# Altium project 飞镖测速模块.PrjPcb
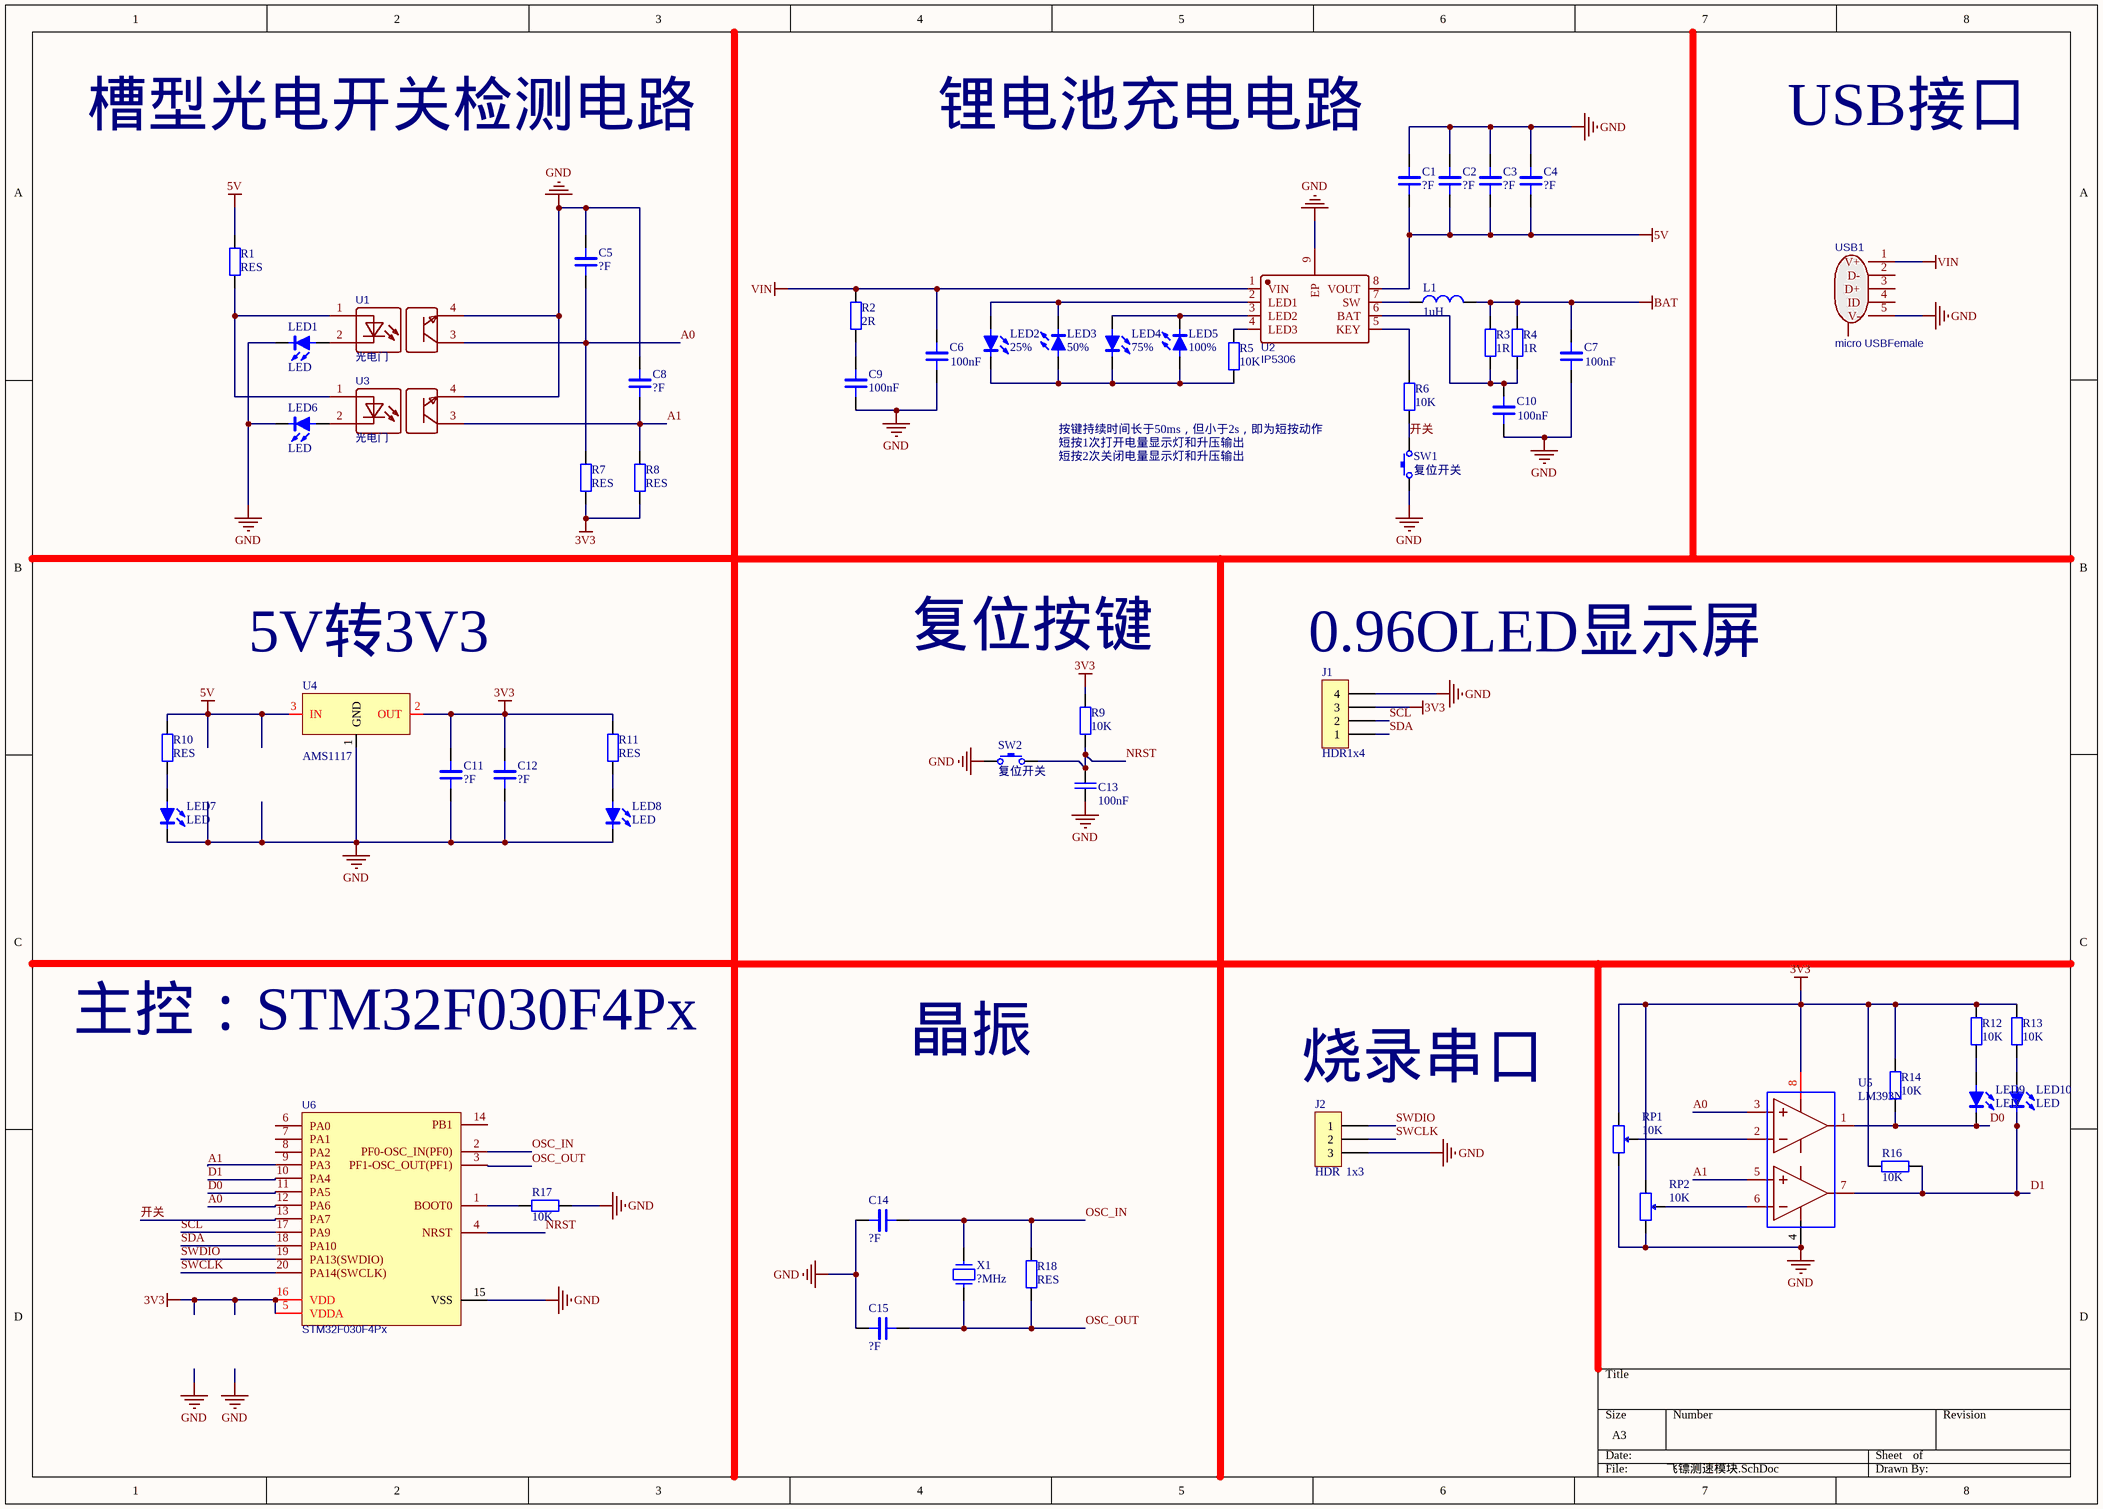
[diagram p0: 飞镖测速模块.SchDoc]
1 sheet, 57 parts. Net scope: global (net labels, ports and power ports of the same name join across sheets).
Board file: 飞镖测速模块.PcbDoc

## Sheet 飞镖测速模块.SchDoc
size A3; SheetNumber: 1; SheetTotal: 1

### Parts
C1  ?F  [1206_C]
C2  ?F  [1206_C]
C3  ?F  [1206_C]
C4  ?F  [1206_C]
C5  ?F  [0603_C]
C6  100nF  [0603_C]
C7  100nF  [0603_C]
C8  ?F  [0603_C]
C9  100nF  [0603_C]
C10  100nF  [0603_C]
C11  ?F  [1206_C]
C12  ?F  [1206_C]
C13  100nF  [0603_C]
C14  ?F  [0603_C]
C15  ?F  [0603_C]
J1  HDR1x4  [排针排母 4P 2.54mm]
J2  HDR  1x3  [排针排母 3P 2.54mm]
L1  1uH  [SMD_4*4*3MM]
LED1  LED  [LED_0603]
LED2  25%  [LED_0603]
LED3  50%  [LED_0603]
LED4  75%  [LED_0603]
LED5  100%  [LED_0603]
LED6  LED  [LED_0603]
LED7  LED  [LED_0603]
LED8  LED  [LED_0603]
LED9  LED  [LED_0603]
LED10  LED  [LED_0603]
R1  RES  [0603_R]
R2  2R  [0603_R]
R3  1R  [0603_R]
R4  1R  [0603_R]
R5  10K  [0603_R]
R6  10K  [0603_R]
R7  RES  [0603_R]
R8  RES  [0603_R]
R9  10K  [0603_R]
R10  RES  [0603_R]
R11  RES  [0603_R]
R12  10K  [0603_R]
R13  10K  [0603_R]
R14  10K  [0603_R]
R16  10K  [0603_R]
R17  10K  [0603_R]
R18  RES  [0603_R]
RP1  10K  [RM065]
RP2  10K  [RM065]
SW1  复位开关  [SW-按键]
SW2  复位开关  [SW-按键]
U1  光电门  [ZGY1150(ITR)]
U2  IP5306  [SOP8-EP]
U3  光电门  [ZGY1150(ITR)]
U4  AMS1117  [SOT-223]
U5  LM393N  [SOP8]
U6  STM32F030F4Px  [TSSOP-20]
USB1  micro USBFemale  [MICRO-USB-SMD_5P-P0.65-H-F_C10418]
X1  ?MHz  [XTAL 直插]

### Nets
3V3: C11.2 C12.2 J1.3 R7.2 R8.2 R9.2 R11.2 R12.1 R13.1 R14.2 R16.1 RP1.1 RP2.1 U4.2(OUT) U5.8(V+) U6.5(VDDA) U6.16(VDD)
5V: C1.1 C2.1 C3.1 C4.1 R1.1 R10.2 U2.8(VOUT) U4.3(IN)
BAT: C7.2 L1.2 R3.2 R4.2
GND: C1.2 C2.2 C3.2 C4.2 C5.2 C6.1 C7.1 C8.2 C9.1 C10.1 C11.1 C12.1 C13.2 C14.2 C15.2 J1.4 J2.3 LED1.2(C) LED6.2(C) LED7.2(C) LED8.2(C) R17.2 RP1.3 RP2.3 SW1.1 SW2.1 U1.4 U2.9(EP) U3.4 U4.1(GND) U5.4(V-) U6.15(VSS) USB1.5(V-)
VIN: C6.2 R2.2 U2.1(VIN) USB1.1(V+)
A0: C5.1 R7.1 U1.3 U5.3(IN_A+) U6.12(PA6)
A1: C8.1 R8.1 U3.3 U5.5(IN_B+) U6.9(PA3)
D0: LED9.2(C) R14.1 U5.1(OUT) U6.11(PA5)
D1: LED10.2(C) R16.2 U5.7(OUT) U6.10(PA4)
NRST: C13.1 R9.1 SW2.2 U6.4(NRST)
OSC_IN: C14.1 R18.2 U6.2(PF0-OSC_IN(PF0)) X1.2
OSC_OUT: C15.1 R18.1 U6.3(PF1-OSC_OUT(PF1)) X1.1
SCL: J1.2 U6.17(PA9)
SDA: J1.1 U6.18(PA10)
SWCLK: J2.2 U6.20(PA14(SWCLK))
SWDIO: J2.1 U6.19(PA13(SWDIO))
开关: R6.1 SW1.2 U6.13(PA7)
NetC9_2: C9.2 R2.1
NetC10_2: C10.2 R3.1 R4.1 U2.6(BAT)
NetL1_1: L1.1 U2.7(SW)
NetLED1_1: LED1.1(A) U1.2
NetLED2_1: LED2.1(A) LED3.2(C) U2.2(LED1)
NetLED2_2: LED2.2(C) LED3.1(A) LED4.2(C) LED5.1(A) R5.1
NetLED4_1: LED4.1(A) LED5.2(C) U2.3(LED2)
NetLED6_1: LED6.1(A) U3.2
NetLED7_1: LED7.1(A) R10.1
NetLED8_1: LED8.1(A) R11.1
NetLED9_1: LED9.1(A) R12.2
NetLED10_1: LED10.1(A) R13.2
NetR1_2: R1.2 U1.1 U3.1
NetR5_2: R5.2 U2.4(LED3)
NetR6_2: R6.2 U2.5(KEY)
NetR17_1: R17.1 U6.1(BOOT0)
NetRP1_2: RP1.2 U5.2(IN_A-)
NetRP2_2: RP2.2 U5.6(IN_B-)

Not connected (* = marked no-connect by the designer): U6 6(PA0) 7(PA1) 8(PA2) 14(PB1); USB1 0(MTN) 2(D-) 3(D+) 4(ID)

### Notes on the sheet
- 槽型光电开关检测电路
- 锂电池充电电路
- USB接口
- 按键持续时间长于50ms，但小于2s，即为短按动作
- 短按1次打开电量显示灯和升压输出
- 短按2次关闭电量显示灯和升压输出
- (near U4) 5V转3V3
- 复位按键
- (near J1) 0.96OLED显示屏
- 主控：STM32F030F4Px
- 晶振
- (near J2) 烧录串口

### Library data of the parts
C1-C12 C14 C15 = CAP: Capacitor
C13 = Cap: Published: 8-Jun-2000; LatestRevisionDate: 17-Jul-2002; LatestRevisionNote: Re-released for DXP Platform.; PackageReference: RAD-0.3; Publisher: Altium Limited
J1 = HDR1x4: Connector
J2 = HDR  1x3: Connector
L1 = Inductor: Code_IEC: 1005; Published: 8-Jun-2000; LatestRevisionDate: 17-Jul-2002; LatestRevisionNote: Re-released for DXP Platform.; PackageReference: 0402-A; Publisher: Altium Limited; Code_JEITA: 0402
LED2-LED5 = LED
R1-R8 R10 R11 R17 R18 = RES: Resistor
R9 R12-R14 R16 = Res: Published: 8-Jun-2000; LatestRevisionDate: 17-Jul-2002; LatestRevisionNote: Re-released for DXP Platform.; PackageReference: AXIAL-0.4; Publisher: Altium Limited
RP1 RP2 = RP-ID: 插件单联电位器; BOM名称: 插件电位器; 版权归属: 源创客; 学习资源: www.ooocke.com
SW1 SW2 = 复位开关: 开关
U1 U3 = 光电门: BOM_Manufacturer: Chau Light; Contributor: LCSC; BOM_Supplier: LCSC; BOM_Supplier Part: C277764; BOM_Manufacturer Part: ZGY1150(ITR); BOM_JLCPCB Part Class: Extended Part; spicePre: U; spiceSymbolName: ZGY1150(ITR)
U2 = IP5306: 电池管理芯片; BOM_Manufacturer: INJOINIC; Contributor: LCSC; BOM_Supplier: LCSC; BOM_Supplier Part: C181692; BOM_Manufacturer Part: IP5306; BOM_JLCPCB Part Class: Extended Part; spicePre: U; spiceSymbolName: IP5306
U4 = AMS1117: LDO
U5 = LM393N: 电压比较器; BOM_Manufacturer: SHOU HAN; BOM_Manufacturer Part: MSK12C02; Contributor: LCSC; BOM_Supplier: LCSC; BOM_Supplier Part: C431540; BOM_JLCPCB Part Class: Extended Part; spicePre: S; spiceSymbolName: MSK12C02
U6 = STM32F030F4Px: STM32单片机; BOM_Manufacturer: STMicroelectronics; BOM_Manufacturer Part: STM32F030F4P6; BOM_Supplier: LCSC; BOM_Supplier Part: C32908; BOM_JLCPCB Part Class: Extended Part; spicePre: U; spiceSymbolName: STM32F030F4P6
USB1 = micro USBFemale: BOM_Manufacturer: ValuePro; BOM_Supplier: LCSC; BOM_Manufacturer Part: micro USBFemale; BOM_Supplier Part: C10418; BOM_JLCPCB Part Class: Extended Part; spicePre: U; spiceSymbolName: micro USBFemale
X1 = XTAL: 8MHz,12MHz